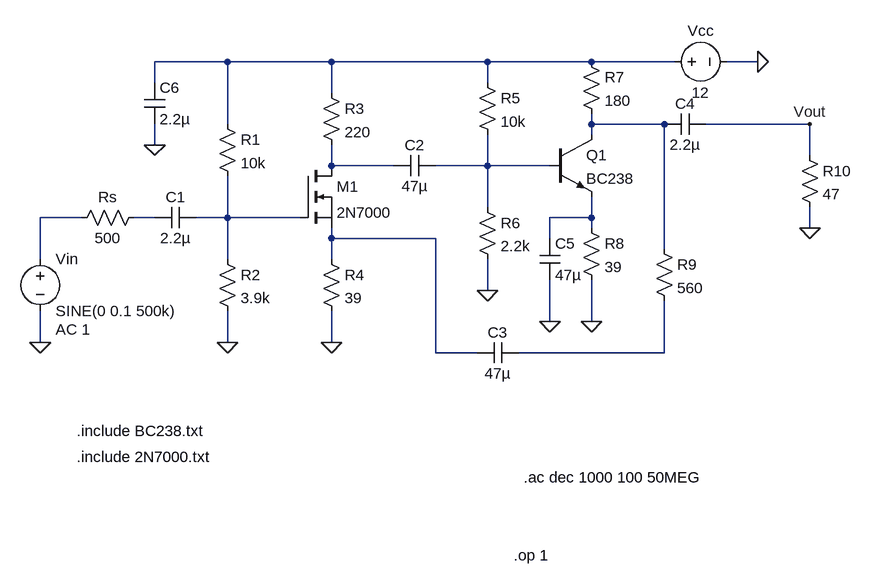
[diagram p0: schematic Lab4.asc]
Lab4.asc, the LTspice schematic file:
Version 4
SHEET 1 1356 680
WIRE 320 -160 208 -160
WIRE 480 -160 320 -160
WIRE 720 -160 480 -160
WIRE 880 -160 720 -160
WIRE 1008 -160 880 -160
WIRE 1136 -160 1088 -160
WIRE 208 -128 208 -160
WIRE 720 -128 720 -160
WIRE 480 -112 480 -160
WIRE 320 -64 320 -160
WIRE 880 -64 880 -80
WIRE 992 -64 880 -64
WIRE 1216 -64 1056 -64
WIRE 880 -48 880 -64
WIRE 208 -32 208 -64
WIRE 1216 -16 1216 -64
WIRE 480 0 480 -32
WIRE 576 0 480 0
WIRE 720 0 720 -48
WIRE 720 0 640 0
WIRE 816 0 720 0
WIRE 720 64 720 0
WIRE 96 80 32 80
WIRE 208 80 176 80
WIRE 320 80 320 16
WIRE 320 80 272 80
WIRE 432 80 320 80
WIRE 880 80 880 48
WIRE 880 80 816 80
WIRE 880 96 880 80
WIRE 1216 96 1216 64
WIRE 480 112 480 96
WIRE 640 112 480 112
WIRE 816 112 816 80
WIRE 992 128 992 -64
WIRE 32 144 32 80
WIRE 320 144 320 80
WIRE 480 144 480 112
WIRE 720 192 720 144
WIRE 816 240 816 176
WIRE 880 240 880 176
WIRE 32 272 32 224
WIRE 320 272 320 224
WIRE 480 272 480 224
WIRE 640 288 640 112
WIRE 704 288 640 288
WIRE 992 288 992 208
WIRE 992 288 768 288
FLAG 32 272 0
FLAG 480 272 0
FLAG 320 272 0
FLAG 720 192 0
FLAG 880 240 0
FLAG 1216 96 0
FLAG 816 240 0
FLAG 208 -32 0
FLAG 1136 -160 0
FLAG 1216 -64 Vout
SYMBOL voltage 32 128 R0
WINDOW 123 24 124 Left 2
WINDOW 39 0 0 Left 0
SYMATTR Value2 AC 1
SYMATTR InstName Vin
SYMATTR Value SINE(0 0.1 500k)
SYMBOL res 192 64 R90
WINDOW 0 0 56 VBottom 2
WINDOW 3 32 56 VTop 2
SYMATTR InstName Rs
SYMATTR Value 500
SYMBOL cap 272 64 R90
WINDOW 0 0 32 VBottom 2
WINDOW 3 32 32 VTop 2
SYMATTR InstName C1
SYMATTR Value 2.2µ
SYMBOL res 304 -80 R0
SYMATTR InstName R1
SYMATTR Value 10k
SYMBOL res 304 128 R0
SYMATTR InstName R2
SYMATTR Value 3.9k
SYMBOL nmos 432 0 R0
SYMATTR InstName M1
SYMATTR Value 2N7000
SYMBOL res 464 -128 R0
SYMATTR InstName R3
SYMATTR Value 220
SYMBOL res 464 128 R0
SYMATTR InstName R4
SYMATTR Value 39
SYMBOL cap 640 -16 R90
WINDOW 0 0 32 VBottom 2
WINDOW 3 32 32 VTop 2
SYMATTR InstName C2
SYMATTR Value 47µ
SYMBOL res 704 -144 R0
SYMATTR InstName R5
SYMATTR Value 10k
SYMBOL res 704 48 R0
SYMATTR InstName R6
SYMATTR Value 2.2k
SYMBOL npn 816 -48 R0
SYMATTR InstName Q1
SYMATTR Value BC238
SYMBOL res 864 -176 R0
SYMATTR InstName R7
SYMATTR Value 180
SYMBOL res 864 80 R0
SYMATTR InstName R8
SYMATTR Value 39
SYMBOL cap 768 272 R90
WINDOW 0 0 32 VBottom 2
WINDOW 3 32 32 VTop 2
SYMATTR InstName C3
SYMATTR Value 47µ
SYMBOL cap 1056 -80 R90
WINDOW 0 0 32 VBottom 2
WINDOW 3 32 32 VTop 2
SYMATTR InstName C4
SYMATTR Value 2.2µ
SYMBOL cap 800 112 R0
SYMATTR InstName C5
SYMATTR Value 47µ
SYMBOL cap 192 -128 R0
SYMATTR InstName C6
SYMATTR Value 2.2µ
SYMBOL voltage 992 -160 R270
WINDOW 0 32 56 VTop 2
WINDOW 3 -32 56 VBottom 2
WINDOW 123 0 0 Left 0
WINDOW 39 0 0 Left 0
SYMATTR InstName Vcc
SYMATTR Value 12
SYMBOL res 1200 -32 R0
SYMATTR InstName R10
SYMATTR Value 47
SYMBOL res 976 112 R0
SYMATTR InstName R9
SYMATTR Value 560
TEXT 88 408 Left 2 !.include BC238.txt
TEXT 88 448 Left 2 !.include 2N7000.txt
TEXT 776 480 Left 2 !.ac dec 1000 100 50MEG
TEXT 760 600 Left 2 !.op 1

The netlist it stands for:
* Lab4.asc
Vin N005 0 SINE(0 0.1 500k) AC 1
Rs N006 N005 500
C1 N007 N006 2.2µ
R1 N001 N007 10k
R2 N007 0 3.9k
M1 N003 N007 N009 N009 2N7000
R3 N001 N003 220
R4 N009 0 39
C2 N004 N003 47µ
R5 N001 N004 10k
R6 N004 0 2.2k
Q1 N002 N004 N008 0 BC238
R7 N001 N002 180
R8 N008 0 39
C3 N010 N009 47µ
C4 Vout N002 2.2µ
C5 N008 0 47µ
C6 N001 0 2.2µ
Vcc N001 0 12
R10 Vout 0 47
R9 N002 N010 560
.model NPN NPN
.model PNP PNP
.lib standard.bjt
.model NMOS NMOS
.model PMOS PMOS
.lib standard.mos
.include BC238.txt
.include 2N7000.txt
.ac dec 1000 100 50MEG
.op 1
.backanno
.end